# EAGLE design tick-pcf2129t-breakout-mk-1.0 (EAGLE 7.5.0)
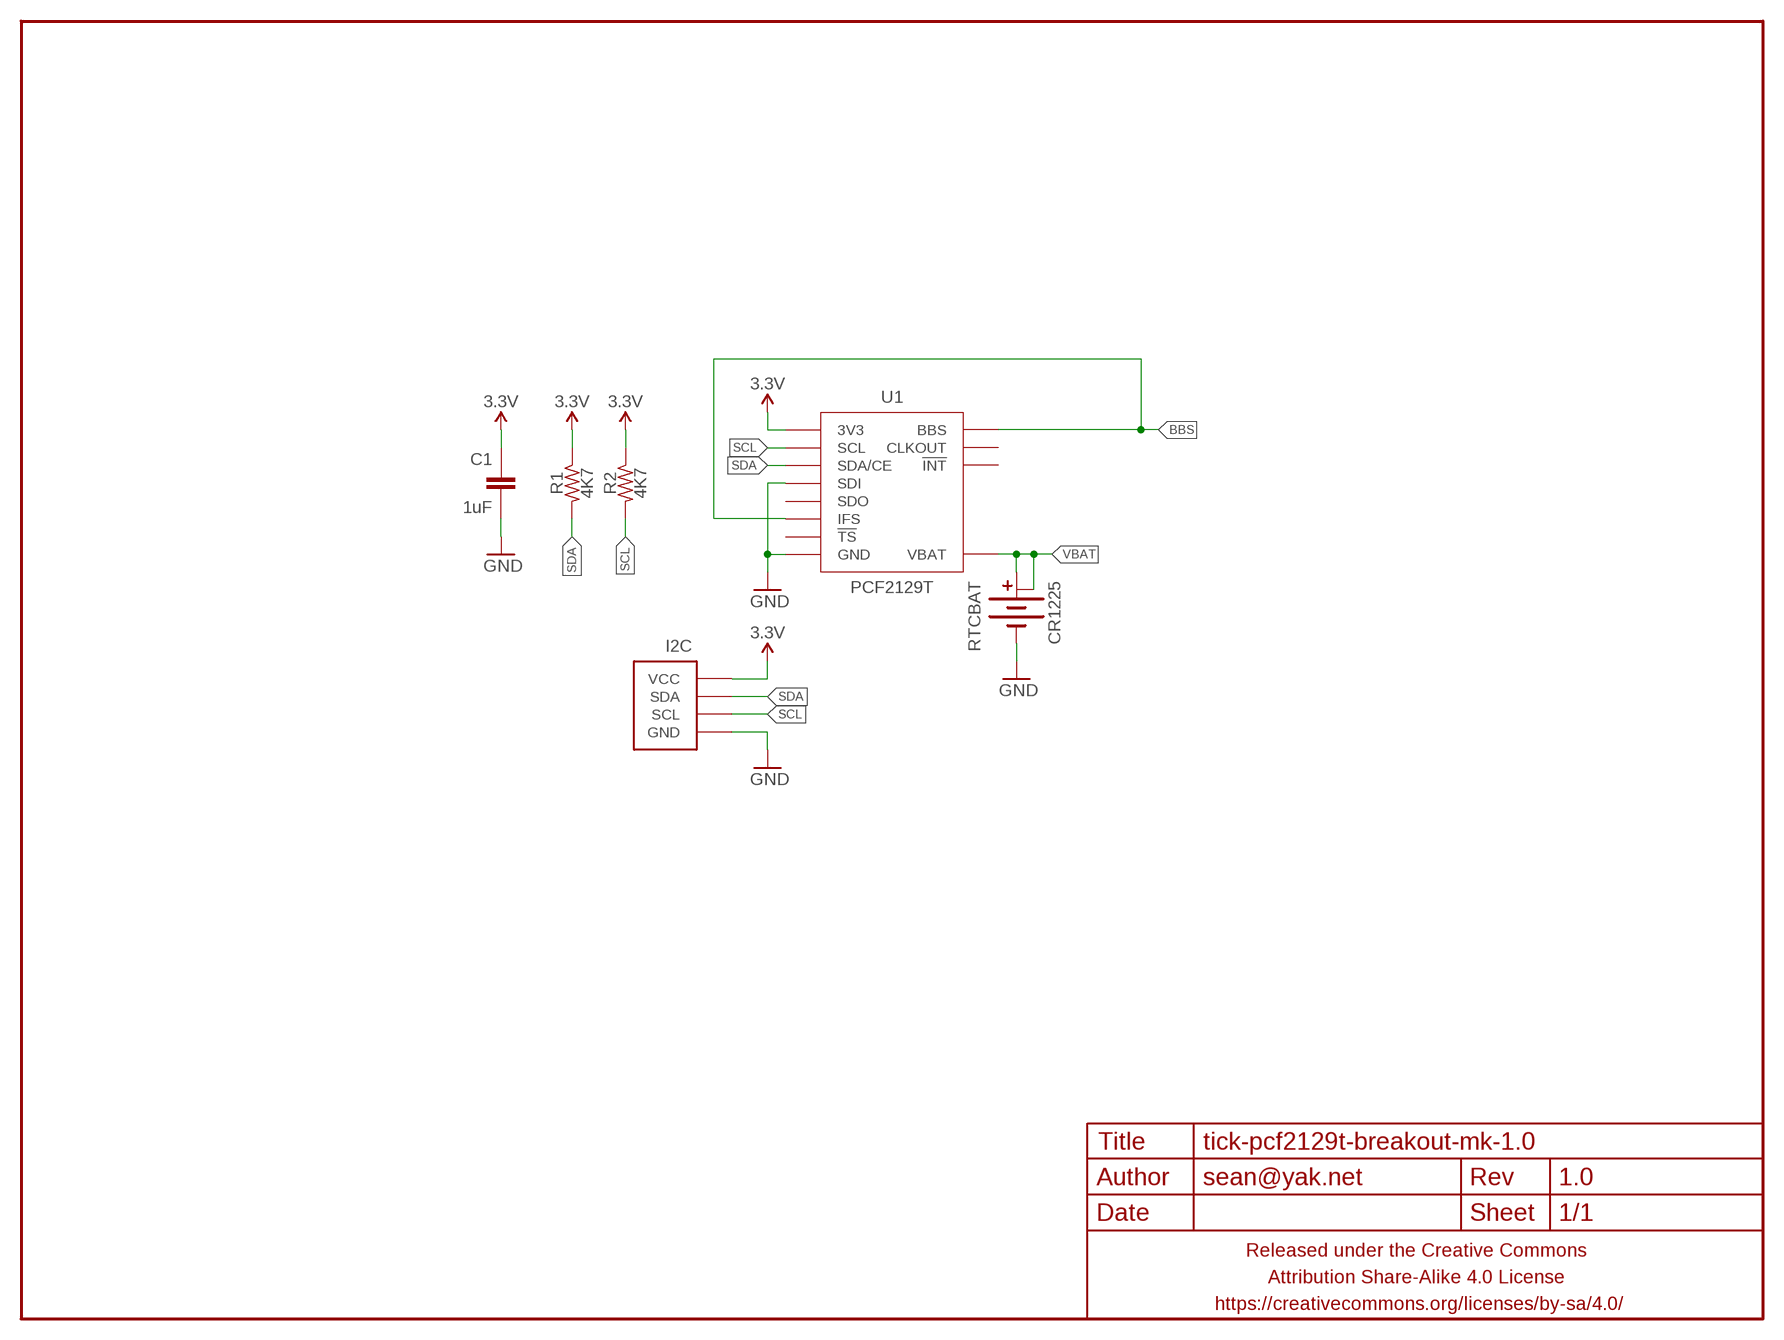
[diagram p0: schematic, sheet 1]

## Parts
C1  1uF  CAPACITOR-CERAMICC0603-TIGHTER  [C0603-TIGHTER]
FRAME1  FRAME-LETTERNO_PACKAGE  [DUMMY]
I2C  M04-I2CPTH-0.1IN-CENTERED  [1X04-PTH-VERT-I2C-CENTERED]
R1  4K7  RESISTORR0603-TIGHTER  [R0603-TIGHTER]
R2  4K7  RESISTORR0603-TIGHTER  [R0603-TIGHTER]
RTCBAT  CR1225  BATTERY-COINCR1225_SMD_SMALLER  [BATTCON_12MM_SMD]
U1  PCF2129T  PCF2129SO16W  [SO16W]

## Nets
3.3V: C1.1 I2C.VCC R1.1 R2.1 U1.16(3V3)
BBS: U1.5(IFS) U1.14(BBS)
GND: C1.2 I2C.GND RTCBAT.- U1.2(SDI) U1.8(GND)
SCL: I2C.SCL R2.2 U1.1(SCL)
SDA: I2C.SDA R1.2 U1.4(SDA/CE)
VBAT: RTCBAT.+@1(+) RTCBAT.+@2(+1) U1.15(VBAT)
Unconnected: U1.3(SDO) U1.6(!TS) U1.7(CLKOUT) U1.13(!INT)

## Library data of the parts
C1 = a_parts:CAPACITOR-CERAMIC: CAPACITOR, European symbol
FRAME1 = A_butts:FRAME-LETTER: Schematic Frame Standard 8.5x11 US Letter frame; DESIGNER: sean@yak.net; VERSION: 1.0
I2C = a_parts:M04-I2C
R1 R2 = a_parts:RESISTOR: RESISTOR, American symbol
RTCBAT = a_parts:BATTERY-COIN
U1 = a_parts:PCF2129

## Board
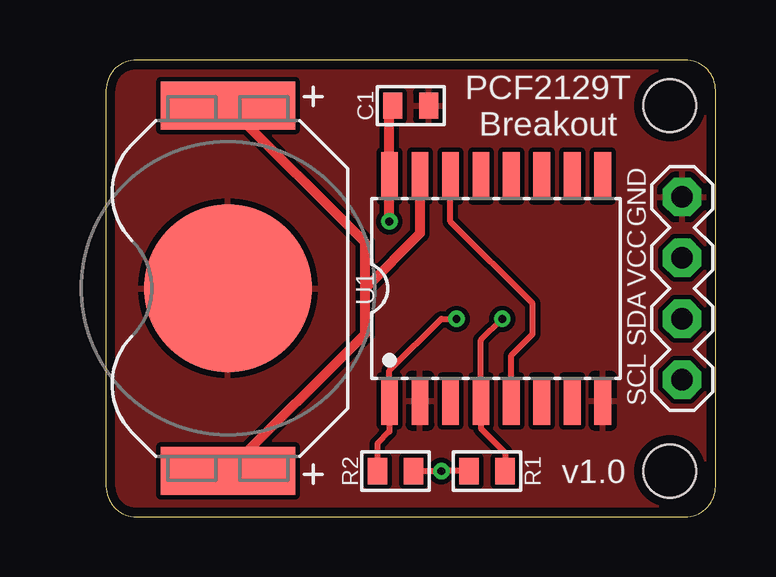
[diagram p1: board, top side]
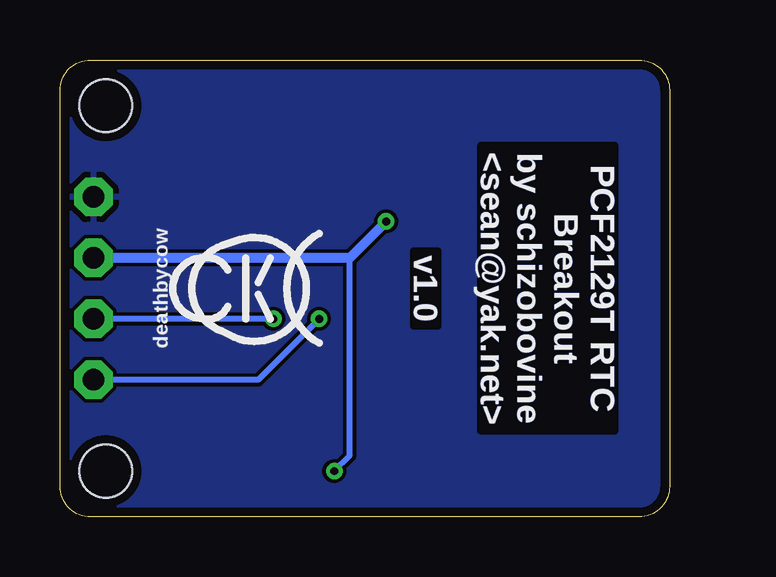
[diagram p2: board, bottom side, seen from below]

Size 25.4 x 19.05 mm. Coordinates in mm from the lower left corner, seen from the top.
Outline: 24.13,19.05 1.27,19.05 arc90 0,17.78 0,1.27 arc90 1.27,0 24.13,0 arc90 25.4,1.27 25.4,17.78 arc90 24.13,19.05
Copper layers (1*16): Top 0.0356mm / dielectric 1.5011mm / Bottom 0.0356mm
Design rules "LaenPCBOrder_2": minimum track width 6mil, minimum drill 13mil, track to track 6mil, track to pad 6mil, pad to pad 6mil, via to via 6mil, smd to smd 6mil, copper to edge 15mil, drill to drill 6mil, minimum pad ring 7mil, minimum via ring 7mil, stop-mask expansion 3mil, vias tented up to drill 20mil, thermal gap 10mil
Holes 2.2 mm at 23.5,1.91 23.5,17.14

### Footprints (pad centres in the part's own frame; a part is rotated, then mirrored left to right if it is on the bottom)
C0603-TIGHTER = smd 0.8 x 1.1: 1 -0.75,0; 2 0.75,0
1X04-PTH-VERT-I2C-CENTERED = drill 0.9 pad 1.6 octagon: GND -3.81,0; SCL 3.81,0; SDA 1.27,0; VCC -1.27,0
R0603-TIGHTER = smd 0.8 x 1.1: 1 -0.75,0; 2 0.75,0
BATTCON_12MM_SMD = smd 2 x 5.6: +@1 -7.62,0; +@2 7.62,0 | smd 7 x 7: - 0,0
SO16W = smd 0.7 x 2: 1 -4.445,-4.685; 2 -3.175,-4.685; 3 -1.905,-4.685; 4 -0.635,-4.685; 5 0.635,-4.685; 6 1.905,-4.685; 7 3.175,-4.685; 8 4.445,-4.685; 9 4.445,4.685; 10 3.175,4.685; 11 1.905,4.685; 12 0.635,4.685; 13 -0.635,4.685; 14 -1.905,4.685; 15 -3.175,4.685; 16 -4.445,4.685

### Placement (x,y rotation side)
C1  12.7,17.14 0 top
FRAME1  0,0 0 top
I2C  24,9.53 270 top
R1  15.88,1.91 0 top
R2  12.06,1.91 180 top
RTCBAT  5.08,9.53 270 top
U1  16.26,9.53 0 top
U$1  [COW_SMALL]  17.14,9.53 270 bottom

### Tracks (layer width: path | path; a pad name or v marks a point on that pad's centre or on a via)
3.3V  (via drill 0.33)
  Top 0.254: R2.1 v13.97,1.91 R1.1
  Top 0.406: v11.81,12.32 U1.16 11.81,17.01 C1.1
  Bottom 0.254: 13.34,10.79 13.34,2.54 v13.97,1.91
  Bottom 0.406: I2C.VCC 13.34,10.79 v11.81,12.32
BBS
  Top 0.254: U1.5 16.89,6.73 17.78,7.62 17.78,8.89 14.35,12.32 U1.14
GND
  pour Top (isolate 0.2): 0,1.27 0,17.78 arc-90 1.27,19.05 24.13,19.05 arc-90 25.4,17.78 25.4,1.27 arc-90 24.13,0 1.27,0 arc-90
  pour Bottom: 24.13,0 1.27,0 arc-90 0,1.27 0,17.78 arc-90 1.27,19.05 24.13,19.05 arc-90 25.4,17.78 25.4,1.27 arc-90
SCL  (via drill 0.33)
  Top 0.254: R2.2 11.3,3.05 11.81,3.56 U1.1 11.81,6.1 13.97,8.26 v14.61,8.26
  Bottom 0.254: v14.61,8.26 17.14,5.71 I2C.SCL
SDA  (via drill 0.33)
  Top 0.254: R1.2 16.64,1.92 16.64,2.67 15.62,3.68 U1.4 15.62,7.37 v16.51,8.26
  Bottom 0.254: v16.51,8.26 I2C.SDA
VBAT
  Top 0.406: RTCBAT.+@1 10.79,11.43 10.79,9.53 | RTCBAT.+@2 10.79,7.62 10.79,9.53 | U1.15 13.08,11.81 10.79,9.53

### Text on the board
Bottom: PCF2129T RTC / Breakout / by schizobovine / <sean@yak.net>
tPlace: PCF2129T / Breakout
bPlace: PCF2129T RTC / Breakout / by schizobovine / <sean@yak.net>